# EAGLE design Mask Blinker (EAGLE 5.11)
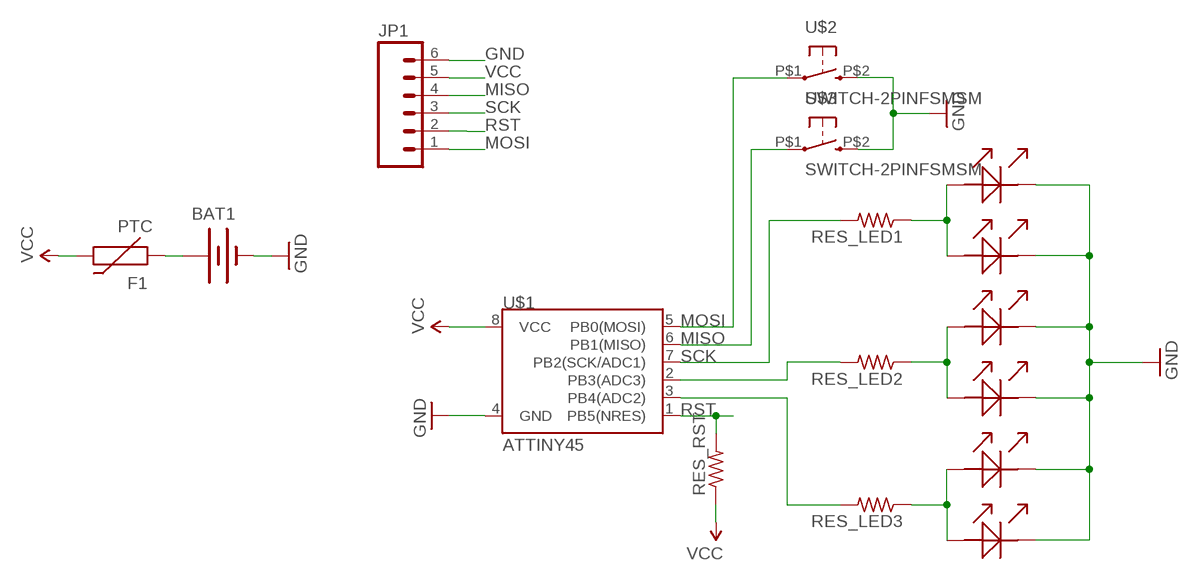
[diagram p0: schematic, sheet 1]

## Parts
BAT1  BATTERYBA2032SM  [BA2032SM]
F1  PTC  [R0805]
JP1  M06SIP  [1X06]
L_LED1  LED0603  [0603]
L_LED2  LED0603  [0603]
L_LED3  LED0603  [0603]
R_LED1  LED0603  [0603]
R_LED2  LED0603  [0603]
R_LED3  LED0603  [0603]
RES_LED1  R-US_R0805  [R0805]
RES_LED2  R-US_R0805  [R0805]
RES_LED3  R-US_R0805  [R0805]
RES_RST  R-US_R0805  [R0805]
U$1  ATTINY45  [SO08-EIAJ]
U$2  SWITCH-2PINFSMSM  [FSMSM-BUTTON]
U$3  SWITCH-2PINFSMSM  [FSMSM-BUTTON]

## Nets
GND: BAT1.- JP1.6 L_LED1.2(-) L_LED2.2(-) L_LED3.2(-) R_LED1.2(-) R_LED2.2(-) R_LED3.2(-) U$1.4(GND) U$2.P$2 U$3.P$2
MISO: JP1.4 U$1.6(PB1(MISO)) U$3.P$1
MOSI: JP1.1 U$1.5(PB0(MOSI)) U$2.P$1
N$1: RES_LED3.2 U$1.3(PB4(ADC2))
N$2: L_LED1.1(+) R_LED1.1(+) RES_LED1.1
N$3: L_LED2.1(+) R_LED2.1(+) RES_LED2.1
N$4: L_LED3.1(+) R_LED3.1(+) RES_LED3.1
N$5: RES_LED2.2 U$1.2(PB3(ADC3))
N$6: BAT1.+ F1.1
RST: JP1.2 RES_RST.2 U$1.1(PB5(NRES))
SCK: JP1.3 RES_LED1.2 U$1.7(PB2(SCK/ADC1))
VCC: F1.2 JP1.5 RES_RST.1 U$1.8(VCC)

## Library data of the parts
BAT1 = Mine:BATTERY: Battery Holders Various common sizes : AA, AAA, 20mm coin cell and 12mm coin cell.
F1 = Mine:PTC: Resettable Fuse PTC Resettable Fuse. Spark Fun Electronics SKU : COM-08357
JP1 = SparkFun:M06: Header 6 Standard 6-pin 0.1" header. Use with straight break away headers (SKU : PRT-00116), right angle break away headers (PRT-00553), swiss pins (PRT-00743), machine pins (PRT-00117), and female headers (PRT-00115). Molex polarized connector foot print use with SKU : PRT-08094 with associated crimp pins and housings. NOTES ON THE VARIANTS LOCK and LOCK_LONGPADS... This footprint was designed to help hold the alignment of a through-hole component (i.e. 6-pin header) while soldering it into place. You may notice that each hole has been shifted either up or down by 0.005 of an inch from it's more standard position (which is a perfectly straight line). This slight alteration caused the pins (the squares in the middle) to touch the edges of the holes. Because they are alternating, it causes a "brace" to hold the component in place. 0.005 has proven to be the perfect amount of "off-center" position when using our standard breakaway headers. Although looks a little odd when you look at the bare footprint, once you have a header in there, the alteration is very hard to notice. Also, if you push a header all the way into place, it is covered up entirely on the bottom side. This idea of altering the position of holes to aid alignment will be further integrated into the Sparkfun Library for other footprints. It can help hold any component with 3 or more connection pins.
L_LED1-L_LED3 R_LED1-R_LED3 = Mine:LED
RES_LED1-RES_LED3 RES_RST = resistor:R-US_: RESISTOR, American symbol
U$1 = SparkFun:ATTINY45: Atmel ATTiny45
U$2 U$3 = Mine:SWITCH-2PIN

## Board
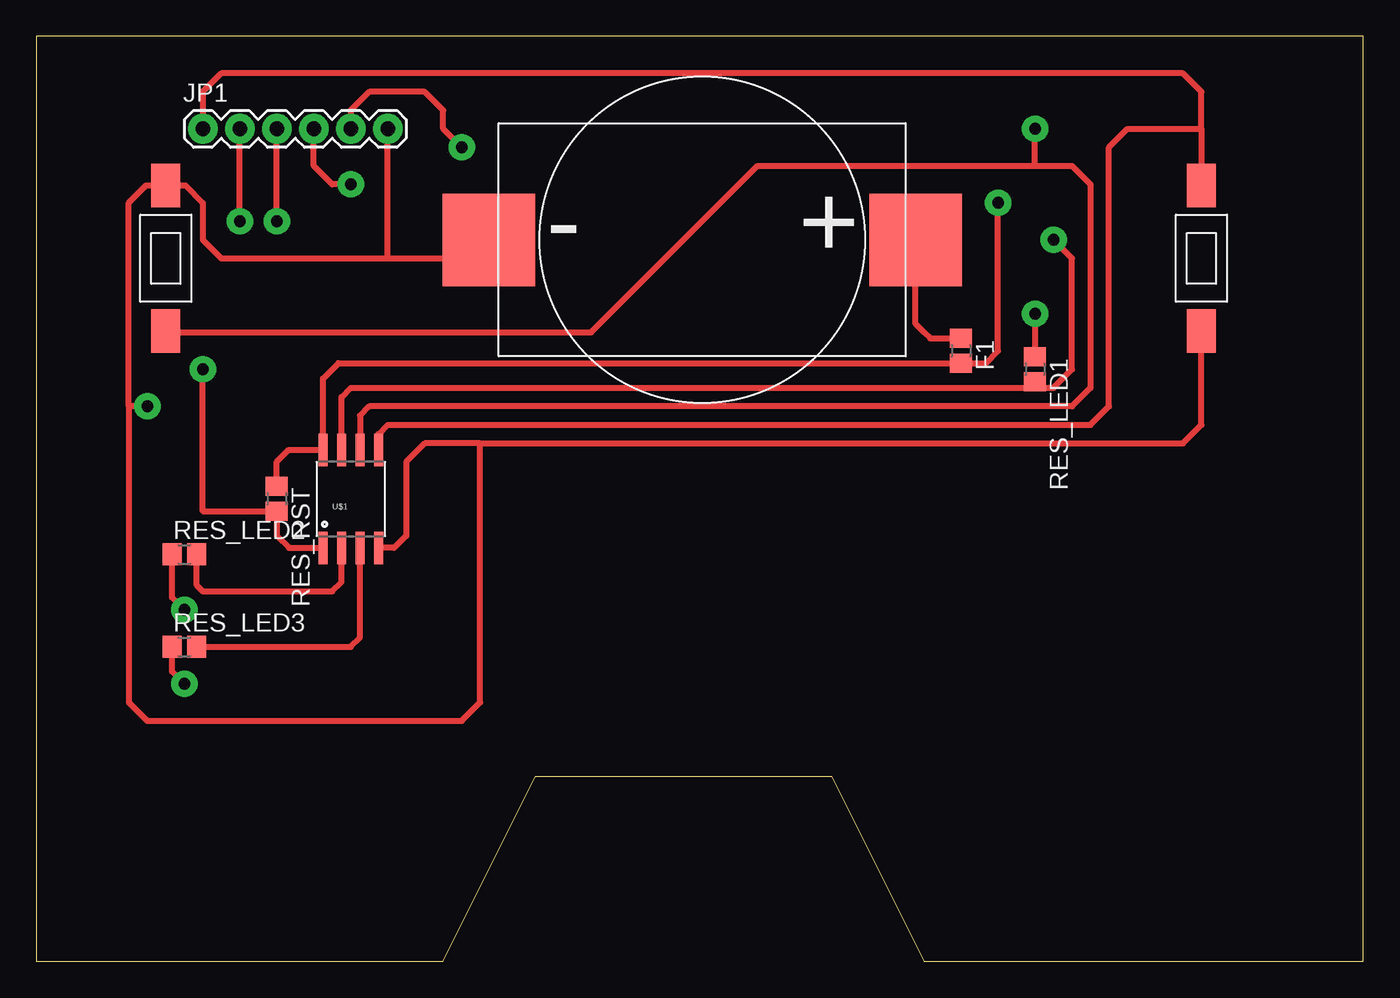
[diagram p1: board, top side]
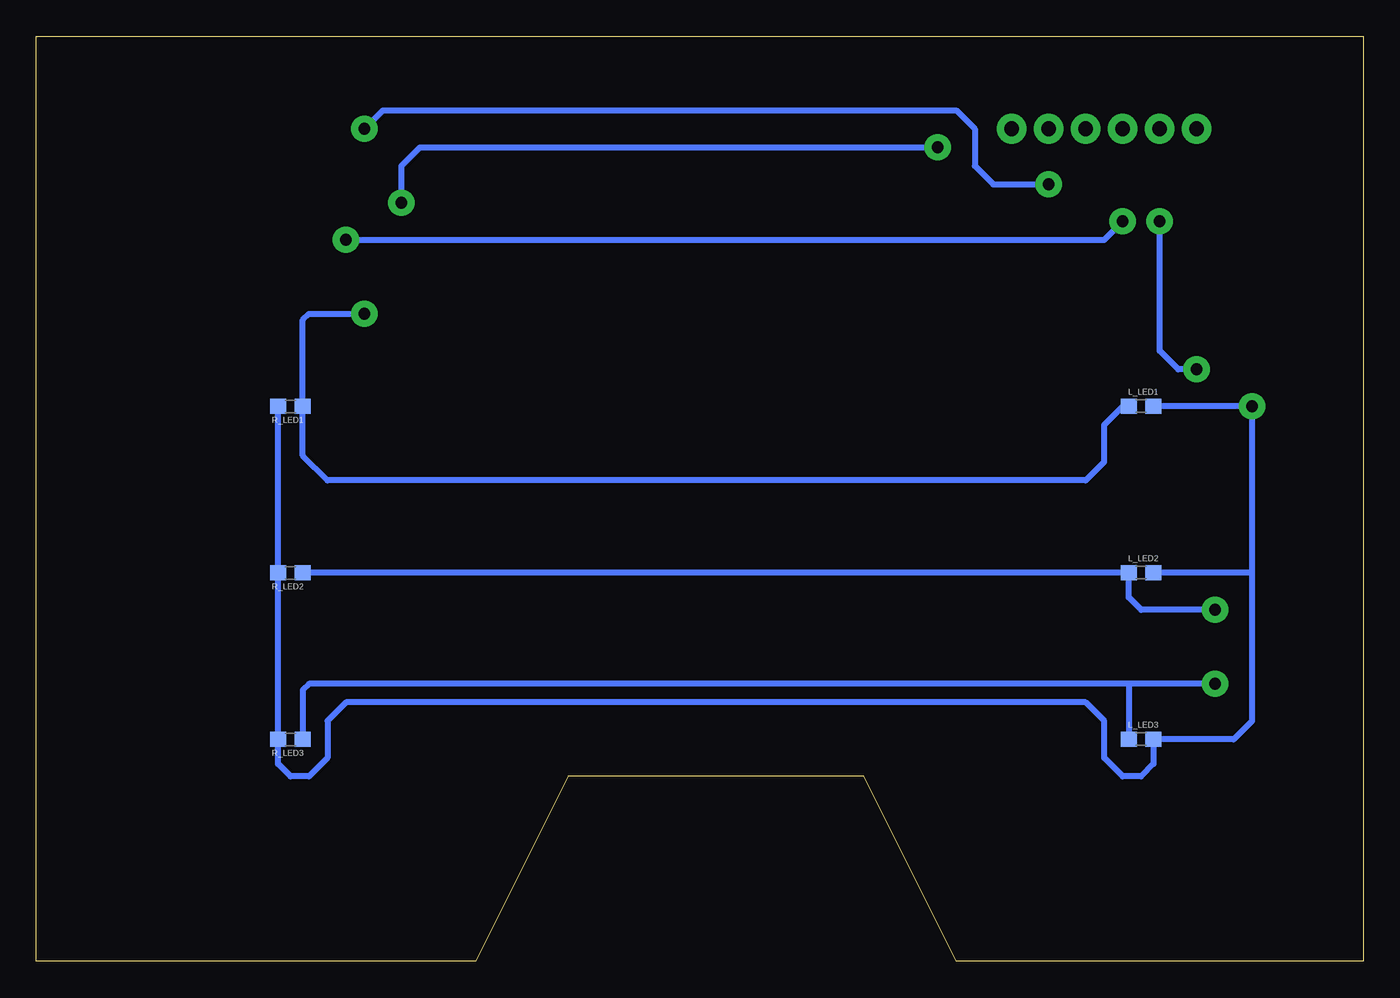
[diagram p2: board, bottom side, seen from below]

Size 91.11 x 63.49 mm. Coordinates in mm from the lower left corner, seen from the top.
Outline: 0,0 27.94,0 34.29,12.7 54.61,12.7 60.96,0 91.11,0 91.11,63.49 0,63.49 0,0
Copper layers (1*16): Top 0.035mm / dielectric 1.5mm / Bottom 0.035mm
Design rules "default *": minimum track width 16mil, minimum drill 31mil, track to track 20mil, track to pad 20mil, pad to pad 20mil, via to via 20mil, smd to smd 0mil, copper to edge 40mil, drill to drill 20mil, minimum pad ring 20mil, minimum via ring 20mil, stop-mask expansion 4mil, vias tented up to drill 0mil, thermal gap 10mil

### Footprints (pad centres in the part's own frame; a part is rotated, then mirrored left to right if it is on the bottom)
BA2032SM = smd 6.35 x 6.35: + 14.656,0; - -14.656,0
R0805 = smd 1.3 x 1.5: 1 -0.85,0; 2 0.85,0
1X06 = drill 1.016 pad 1.88 round: 1 0,0; 2 2.54,0; 3 5.08,0; 4 7.62,0; 5 10.16,0; 6 12.7,0
0603 = smd 1.1 x 1: 1 -0.85,0; 2 0.85,0
SO08-EIAJ = smd 0.61 x 2.21: 1 -1.905,-3.378; 2 -0.635,-3.378; 3 0.635,-3.378; 4 1.905,-3.378; 5 1.905,3.353; 6 0.635,3.353; 7 -0.635,3.353; 8 -1.905,3.353
FSMSM-BUTTON = smd 3 x 2: P$1 5,0; P$2 -5,0

### Placement (x,y rotation side)
BAT1  45.72,49.53 0 top
F1  63.5,41.91 270 top
JP1  11.43,57.15 0 top
L_LED1  15.24,38.1 0 bottom
L_LED2  15.24,26.67 0 bottom
L_LED3  15.24,15.24 0 bottom
R_LED1  73.66,38.1 180 bottom
R_LED2  73.66,26.67 180 bottom
R_LED3  73.66,15.24 180 bottom
RES_LED1  68.58,40.64 270 top
RES_LED2  10.16,27.94 0 top
RES_LED3  10.16,21.59 0 top
RES_RST  16.51,31.75 270 top
U$1  21.59,31.75 0 top
U$2  80.01,48.26 90 top
U$3  8.89,48.26 270 top

### Tracks (layer width: path | path; a pad name or v marks a point on that pad's centre or on a via)
GND  (via drill 0.8)
  Top 0.406: 24.13,48.26 JP1.6 | 30.48,35.56 30.48,17.78 29.21,16.51 7.62,16.51 6.35,17.78 6.35,38.1 | U$2.P$2 80.01,36.83 78.74,35.56 30.48,35.56 | BAT1.- 30.48,49.53 30.48,48.26 24.13,48.26 | v7.62,38.1 6.35,38.1 | 24.13,48.26 12.7,48.26 11.43,49.53 11.43,52.07 10.24,53.26 U$3.P$2 7.54,53.26 6.35,52.07 6.35,38.1 | U$1.4 24.56,28.37 25.4,29.21 25.4,34.29 26.67,35.56 30.48,35.56
  Bottom 0.406: R_LED1.2 R_LED2.2 R_LED3.2 74.51,13.55 73.66,12.7 72.39,12.7 71.12,13.97 71.12,16.51 69.85,17.78 19.05,17.78 17.78,16.51 17.78,13.97 16.51,12.7 15.24,12.7 14.39,13.55 L_LED3.2 8.89,15.24 7.62,16.51 7.62,26.67 | L_LED1.2 v7.62,38.1 7.62,26.67 | 7.62,26.67 L_LED2.2
MISO  (via drill 0.8)
  Top 0.406: v21.59,53.34 20.32,53.34 19.05,54.61 JP1.4 | 68.58,54.61 v68.58,57.15 | 68.58,54.61 49.53,54.61 38.1,43.18 8.89,43.18 U$3.P$1 | 68.58,54.61 71.12,54.61 72.39,53.34 72.39,39.37 71.12,38.1 22.86,38.1 22.23,37.47 U$1.6
  Bottom 0.406: v68.58,57.15 67.31,58.42 27.94,58.42 26.67,57.15 26.67,54.61 25.4,53.34 v21.59,53.34
MOSI
  Top 0.406: 80.01,57.15 74.93,57.15 73.66,55.88 73.66,38.1 72.39,36.83 24.13,36.83 23.5,36.2 U$1.5 | JP1.1 11.43,59.69 12.7,60.96 78.74,60.96 80.01,59.69 80.01,57.15 | 80.01,57.15 U$2.P$1
N$1
  Top 0.406: RES_LED3.2 21.59,21.59 22.23,22.23 U$1.3
N$2  (via drill 0.8)
  Top 0.406: v68.58,44.45 RES_LED1.1
  Bottom 0.406: L_LED1.1 16.51,38.1 17.78,36.83 17.78,34.29 19.05,33.02 71.12,33.02 72.81,34.71 R_LED1.1 72.81,44.03 72.39,44.45 v68.58,44.45
N$3  (via drill 0.8)
  Top 0.406: RES_LED2.1 9.31,24.98 v10.16,24.13
  Bottom 0.406: R_LED2.1 L_LED2.1 16.09,24.98 15.24,24.13 v10.16,24.13
N$4  (via drill 0.8)
  Top 0.406: RES_LED3.1 9.31,19.9 v10.16,19.05
  Bottom 0.406: v10.16,19.05 16.09,19.05 | R_LED3.1 72.81,18.63 72.39,19.05 16.09,19.05 | 16.09,19.05 L_LED3.1
N$5
  Top 0.406: U$1.2 20.95,26.04 20.32,25.4 11.43,25.4 11.01,25.82 RES_LED2.2
N$6
  Top 0.406: F1.1 61.38,42.76 60.96,43.18 60.38,43.76 BAT1.+
RST  (via drill 0.8)
  Top 0.406: v13.97,50.8 JP1.2 | v11.43,40.64 11.43,30.9 RES_RST.2 16.51,29.21 17.35,28.37 U$1.1
  Bottom 0.406: v13.97,50.8 13.97,41.91 12.7,40.64 v11.43,40.64
SCK  (via drill 0.8)
  Top 0.406: v16.51,50.8 JP1.3 | U$1.7 20.95,38.73 21.59,39.37 68.58,39.37 | 68.58,39.37 RES_LED1.2 | 68.58,39.37 69.85,39.37 71.12,40.64 71.12,48.26 v69.85,49.53
  Bottom 0.406: v16.51,50.8 17.78,49.53 v69.85,49.53
VCC  (via drill 0.8)
  Top 0.406: JP1.5 21.59,58.42 22.86,59.69 26.67,59.69 27.94,58.42 27.94,57.15 v29.21,55.88 | RES_RST.1 16.51,34.29 17.32,35.1 U$1.8 19.68,40.01 20.74,41.06 F1.2 65.19,41.06 66.04,41.91 v66.04,52.07
  Bottom 0.406: v29.21,55.88 64.77,55.88 66.04,54.61 v66.04,52.07